# EasyEDA Pro project IP5306锂电池管理模块.epro

# Schematic IP5306充放一体小板_V3.0
Board Name: IP5306充放一体小板_V3.0_接口换插座; Create Date: 2025-09-12; Page Name: power5v; Project Name: IP5306_单MOS控制电路; Schematic Name: IP5306充放一体小板_V3.0; Update Date: 2025-09-12; Company: 嘉立创EDA; Drawed: Robofish; Page Size: A4; Version: V1.0
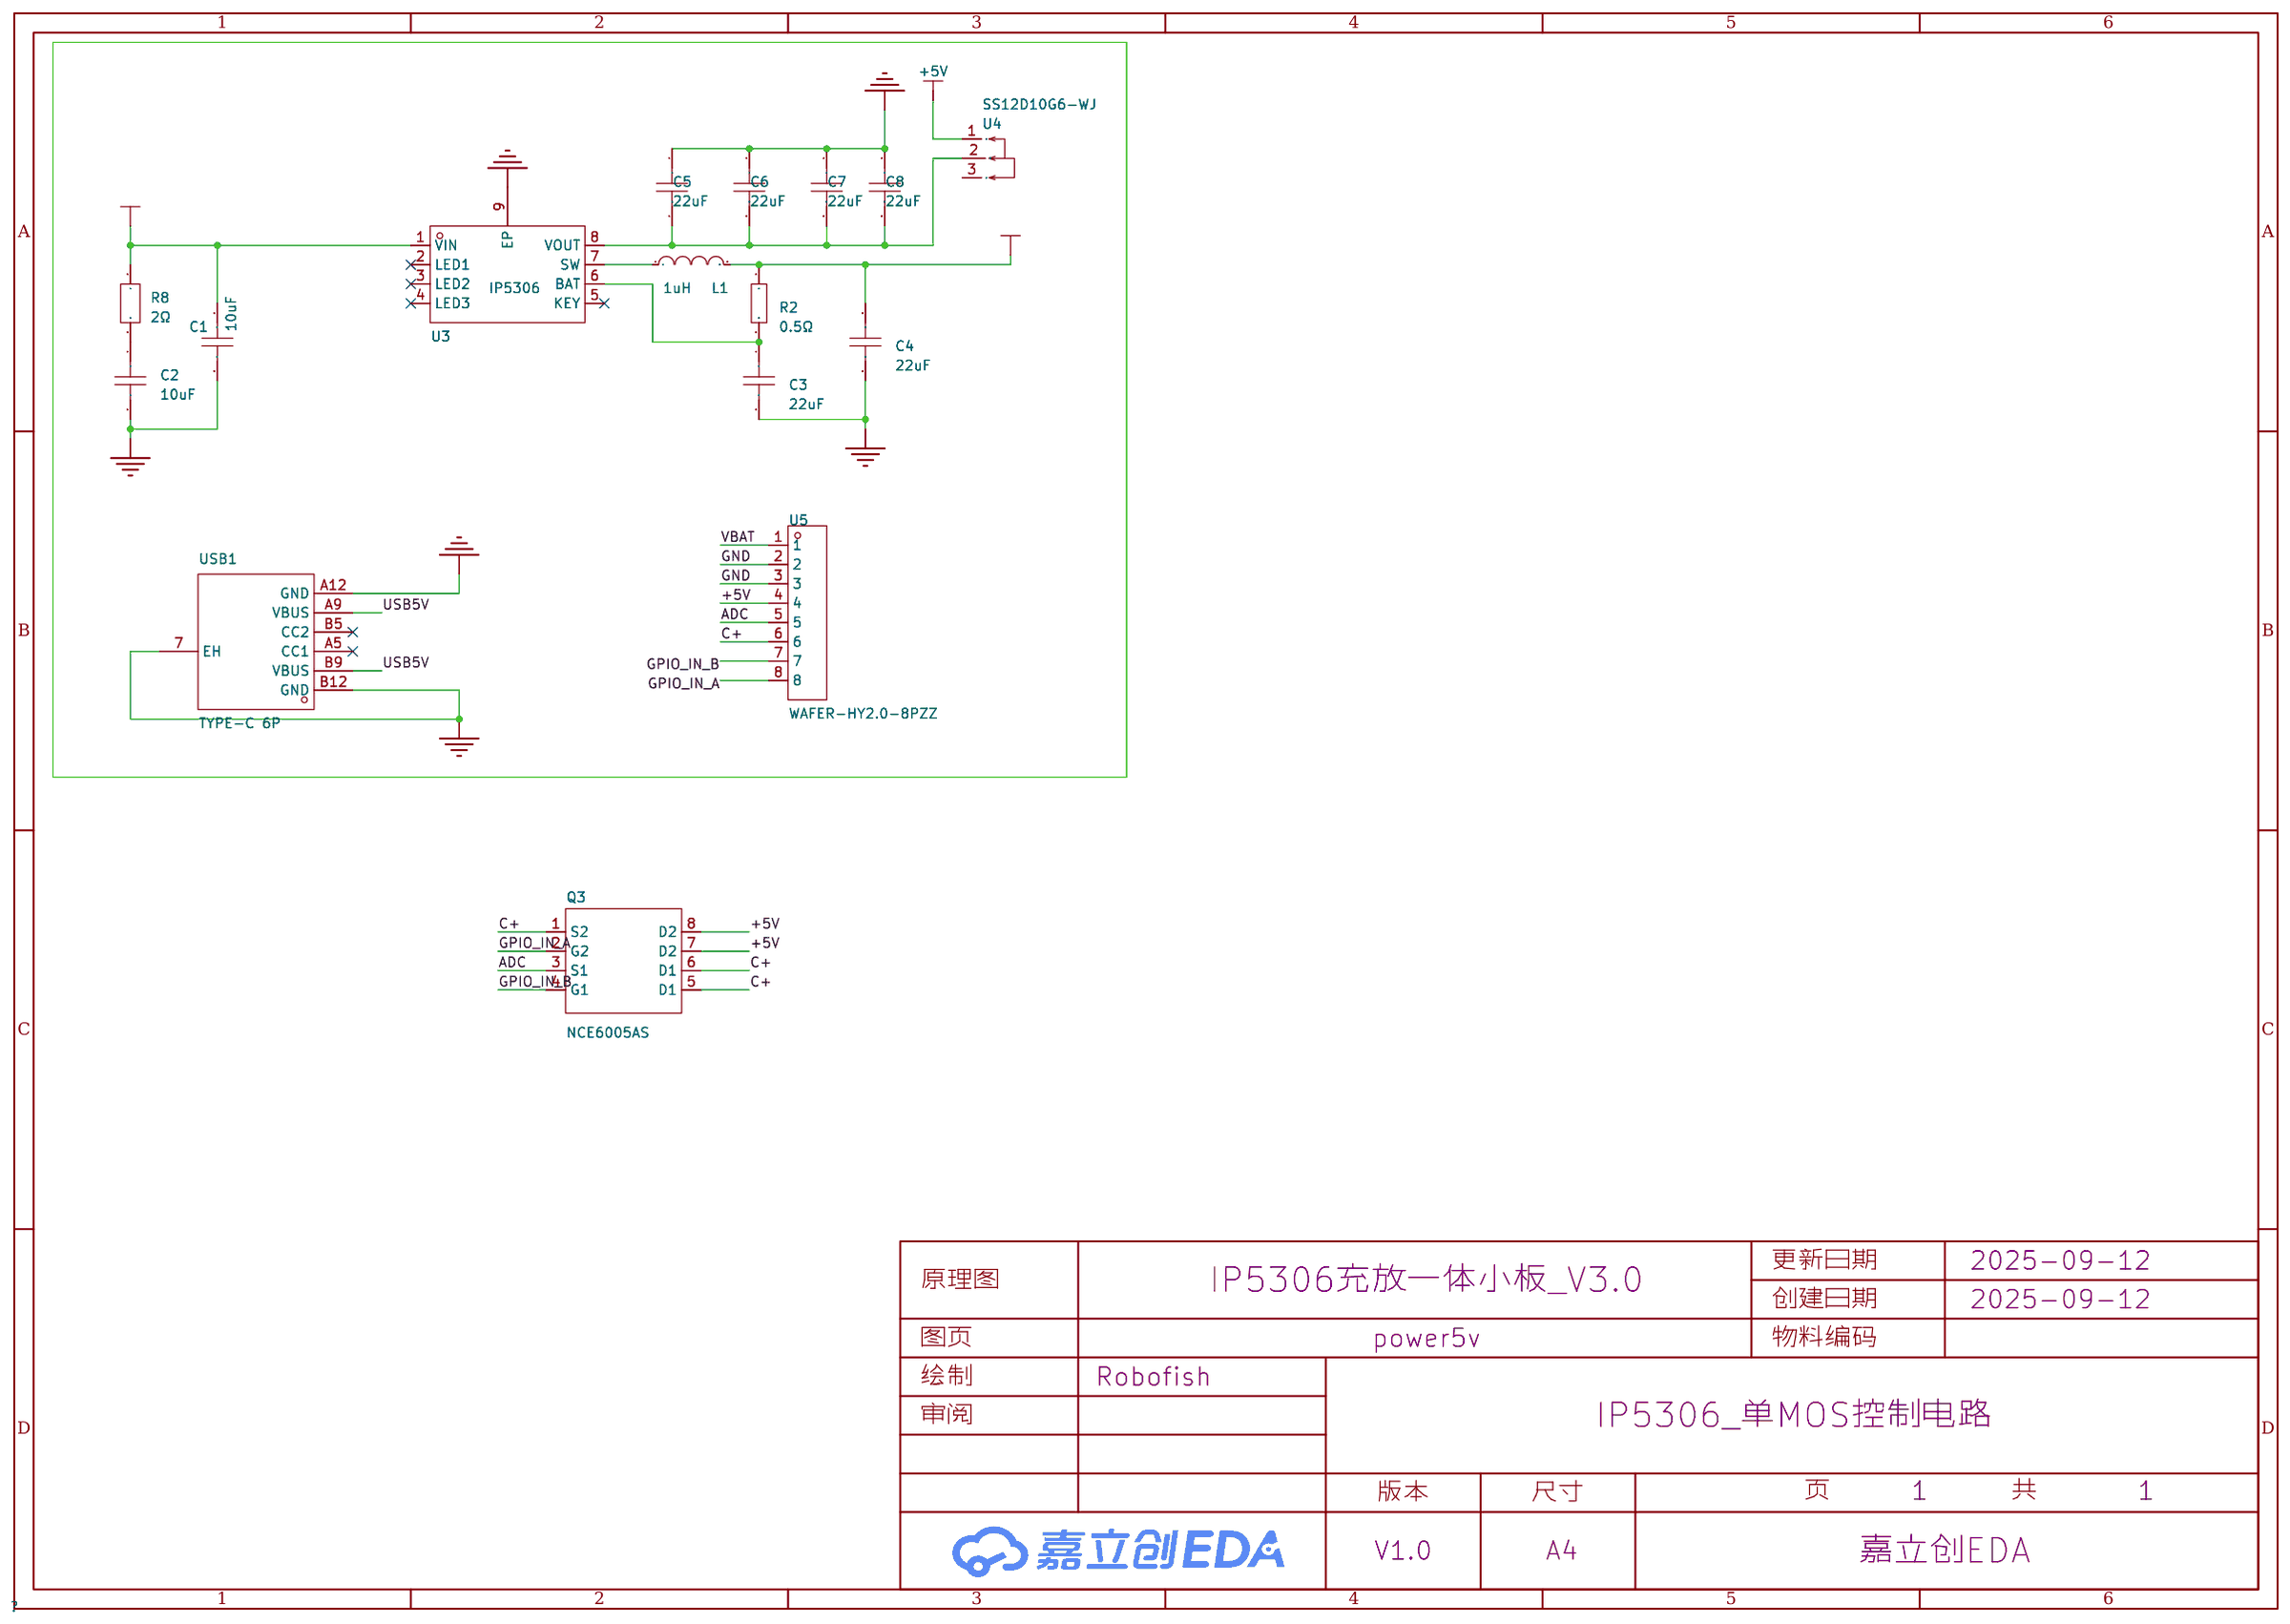
[diagram p0: schematic sheet]

## Parts
C1  10uF  [C0805]
C2  10uF  [C0805]
C3  22uF  [C0805]
C4  22uF  [C0805]
C5  22uF  [C0805]
C6  22uF  [C0805]
C7  22uF  [C0805]
C8  22uF  [C0805]
L1  1uH  [IND-SMD_L4.4-W4.2]
Q3  NCE6005AS  [SOP-8_L4.9-W3.9-P1.27-LS6.0-BL]
R2  0.5Ω  [R0805]
R8  2Ω  [R1206]
U3  IP5306  [ESOP-8_L4.9-W3.9-P1.27-LS6.0-BL-EP]
U4  SS12D10G6-WJ  [SW-TH_3P-P4.80_HX-SS12D10G6-WJ]
U5  WAFER-HY2.0-8PZZ  [CONN-TH_8P-P2.00_WAFER-HY2.0-8PZZ]
USB1  TYPE-C 6P  [TYPE-C-SMD_TYPE-C-6P]

## Library data of the parts
C1 C2 = CL21A106KAYNNNE_C15850: 容值:10uF;精度:±10%;额定电压:25V;材质(温度系数):X5R;; LCSC Part Name: 10uF ±10% 25V; Supplier Part: C15850; Manufacturer: SAMSUNG(三星); Manufacturer Part: CL21A106KAYNNNE; Supplier Footprint: 0805; JLCPCB Part Class: Basic Part; Datasheet: https://atta.szlcsc.com/upload/public/pdf/source/20160218/1457707763339.pdf; Supplier: LCSC; Tolerance: ±10%; Voltage Rated: 25V; Temperature Coefficient: X5R
C3-C8 = CL21A226MAQNNNE_C45783: 容值:22uF;精度:±20%;额定电压:25V;材质(温度系数):X5R;; LCSC Part Name: 22uF ±20% 25V; Supplier Part: C45783; Manufacturer: SAMSUNG(三星); Manufacturer Part: CL21A226MAQNNNE; Supplier Footprint: 0805; JLCPCB Part Class: Basic Part; Datasheet: https://atta.szlcsc.com/upload/public/pdf/source/20160103/1457707727161.pdf; Supplier: LCSC; Tolerance: ±20%; Voltage Rated: 25V; Temperature Coefficient: X5R
L1 = FXL0420-1R0-M: 电感值:1uH;精度:±20%;额定电流:6A;饱和电流(Isat):7A;类型:一体成型电感;; LCSC Part Name: 1uH ±20% 7A; Supplier Part: C167203; Manufacturer: cjiang(长江微电); Supplier Footprint: SMD,4.2x4.4mm; JLCPCB Part Class: 扩展库; Datasheet: https://atta.szlcsc.com/upload/public/pdf/source/20230516/FBADA9890E7FBE97C620F1D8B562D733.pdf; Supplier: LCSC; Tolerance: ±20%; Rated Current: 6A; Saturation Current (Isat): 7A; DC Resistance (DCR): 27mΩ; Type: 一体成型电感
Q3 = NCE6005AS: 数量:2个N沟道;漏源电压(Vdss):60V;连续漏极电流(Id):5A;导通电阻(RDS(on)):45mΩ@4.5V,5A;耗散功率(Pd):2W;阈值电压(Vgs(th)):2.5V@250uA;; LCSC Part Name: 2个N沟道 耐压:60V 电流:5A; Supplier Part: C126151; Manufacturer: NCE(无锡新洁能); Supplier Footprint: SOP-8; JLCPCB Part Class: 扩展库; Datasheet: https://item.szlcsc.com/datasheet/NCE6005AS/137431.html; Supplier: LCSC; Number: 2个N沟道; Drain to Source Voltage: 60V; Current - Continuous Drain(Id): 5A; RDS(on): 45mΩ@4.5V,5A; Pd - Power Dissipation: 2W; Gate Threshold Voltage (Vgs(th)): 2.5V@250uA; Gate Charge(Qg): 22nC@10V; Input Capacitance(Ciss): 979pF; Reverse Transfer Capacitance (Crss@Vds): 100pF; Operating Temperature: -55℃~+150℃; Type: N沟道; Output Capacitance(Coss): 120pF
R2 = 0805W8F500LT5E: 电阻类型:厚膜电阻;阻值:500mΩ;精度:±1%;功率:125mW;最大工作电压:150V;温度系数:±800ppm/℃;; LCSC Part Name: 500mΩ ±1% 125mW 厚膜电阻; Supplier Part: C28319; Manufacturer: UNI-ROYAL(厚声); Supplier Footprint: 0805; JLCPCB Part Class: 扩展库; Datasheet: https://atta.szlcsc.com/upload/public/pdf/source/20200306/C422600_1E6D84923E4A46A82E41ADD87F860B5C.pdf; Supplier: LCSC; Type: 厚膜电阻; Tolerance: ±1%; Power(Watts): 125mW; Overload Voltage (Max): 150V; Temperature Coefficient: ±800ppm/℃; Operating Temperature Range: -55℃~+155℃
R8 = RE1206F1R100: 电阻类型:采样电阻;阻值:100mΩ;精度:±1%;功率:1W;温度系数:±50ppm/℃;; LCSC Part Name: 100mΩ 1W 1206 ±1%; Supplier Part: C46961734; Manufacturer: 捷而瑞; Supplier Footprint: 1206; JLCPCB Part Class: 扩展库; Datasheet: https://atta.szlcsc.com/upload/public/pdf/source/20250325/401775B85EF7B3A580BC34DFED100CB2.pdf; Supplier: LCSC; Type: 采样电阻; Tolerance: ±1%; Power(Watts): 1W; Temperature Coefficient: ±50ppm/℃
U3 = IP5306: 2.1A充电2.4A放电高集成度移动电源SOC; Supplier Part: C181692; Manufacturer: INJOINIC(英集芯); Supplier Footprint: ESOP-8; JLCPCB Part Class: 扩展库; Datasheet: https://atta.szlcsc.com/upload/public/pdf/source/20190627/C384572_9925B3DDC4041BC6108E5AB46A2A0AB1.pdf; Supplier: LCSC
U4 = SS12D10G6-WJ: 电路结构:单刀双掷;安装方式:弯插;开关颜色:黑色;额定电流:2A;额定电压:125V;工作寿命:3千次;; LCSC Part Name: 两档卧式插件 3脚拨动开关弯插 柄长6.0mm; Supplier Part: C7431059; Manufacturer: SHOU HAN(首韩); Supplier Footprint: 插件; JLCPCB Part Class: 扩展库; Datasheet: https://atta.szlcsc.com/upload/public/pdf/source/20240716/65906E925F6A30FB5BD71C0F2E575DBB.pdf; Supplier: LCSC; Circuit: 单刀双掷; Actuator Style: 矩形柱状; Termination Style: PC引脚; Length: 12.7mm; Width: 6.7mm; Switch Height: 12.4mm; Mounting Type: 弯插; Actuator Color: 黑色; Current Rating: 2A; Voltage Rating: 125V; Life: 3千次; Operating Temperature: -25℃~+70℃
U5 = WAFER-HY2.0-8PZZ: 插针结构:1x8P;间距:2mm;安装方式:直插;参考系列:HY;总PIN数:8P;排数:1;每排PIN数:8;行距:-;额定电流:2A;触头材质:黄铜;触头镀层:锡;工作温度:-25℃~+85℃;; LCSC Part Name: 1x8P 间距:2mm 直插 系列:HY; Supplier Part: C5374801; Manufacturer: XUNPU(讯普); Supplier Footprint: 插件,P=2mm; JLCPCB Part Class: 扩展库; Datasheet: https://item.szlcsc.com/datasheet/WAFER-HY2.0-8PZZ/6231113.html; Supplier: LCSC; Pins Structure: 1x8P; Pitch: 2mm; Mounting Type: 直插; Reference Series: HY; Number of Pins: 8P; Number of Rows: 1; Number of PINs Per Row: 8; Current Rating: 2A; Contact Material: 黄铜; Contact Plating: 锡; Operating Temperature: -25℃~+85℃; Voltage Rating: 250V; Plastic Material: LCP; Flame Retardant Rating: UL94V-0; Color: 白色; Z-Height of the Board: 8mm; X-Length of Bottom Edge on Board (Spacing Line): 18mm; Y-Width of Bottom Edge on Board: 5.1mm
USB1 = TYPE-C 6P: 连接器类型:Type-C;标准:USB 3.1;公母:母;安装方式:卧贴;触点数量:6P;端口数量:1;额定电流 - 电源:5A;工作温度范围:-40℃~+85℃;; LCSC Part Name: Type-C 母 卧贴; Supplier Part: C456012; Manufacturer: SHOU HAN(首韩); Supplier Footprint: SMD; JLCPCB Part Class: 扩展库; Datasheet: https://atta.szlcsc.com/upload/public/pdf/source/20201203/C456012_B13F72044DF846EDBE9BDD0D1D3CD166.pdf; Supplier: LCSC; Connector Type: Type-C; Standard: USB 3.1; Gender: 母; Mounting Style: 卧贴; Number of Contacts: 6P; Number of Ports: 1; Current Rating - Power (Max): 5A; Operating Temperature Range: -40℃~+85℃; Rated Voltage (Max): 20V; Connect-Disconnect Life: 3千次; Core Colour: 黑色

## Nets
+5V: Q3.7(D2) Q3.8(D2) U4.1 U5.4
GND: C1.2 C2.2 C3.2 C4.2 C5.1 C6.1 C7.1 C8.1 U3.9(EP) U5.2 U5.3 USB1.7(EH) USB1.A12(GND) USB1.B12(GND)
VBAT: C4.1 L1.2 R2.1 U5.1
ADC: Q3.3(S1) U5.5
C+: Q3.1(S2) Q3.5(D1) Q3.6(D1) U5.6
GPIO_IN_A: Q3.2(G2) U5.8
GPIO_IN_B: Q3.4(G1) U5.7
USB5V: C1.1 R8.1 U3.1(VIN) USB1.A9(VBUS) USB1.B9(VBUS)
$1N828: L1.1 U3.7(SW)
$1N4798: C2.1 R8.2
$1N6635: C3.1 R2.2 U3.6(BAT)
$1N7530: C5.2 C6.2 C7.2 C8.2 U3.8(VOUT) U4.2

Not connected (* = marked no-connect by the designer): U3 2(LED1)* 3(LED2)* 4(LED3)* 5(KEY)*; U4 3; USB1 A5(CC1)* B5(CC2)*

# Board IP5306充放一体小板_V3.0
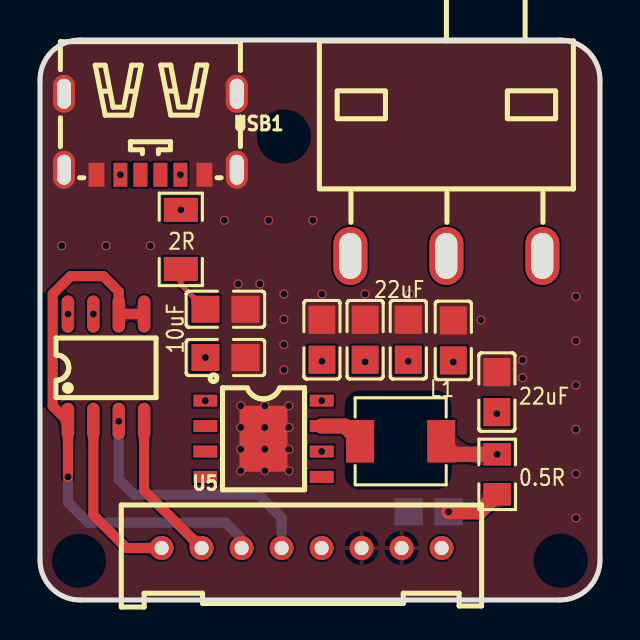
[diagram p1: board, top side]
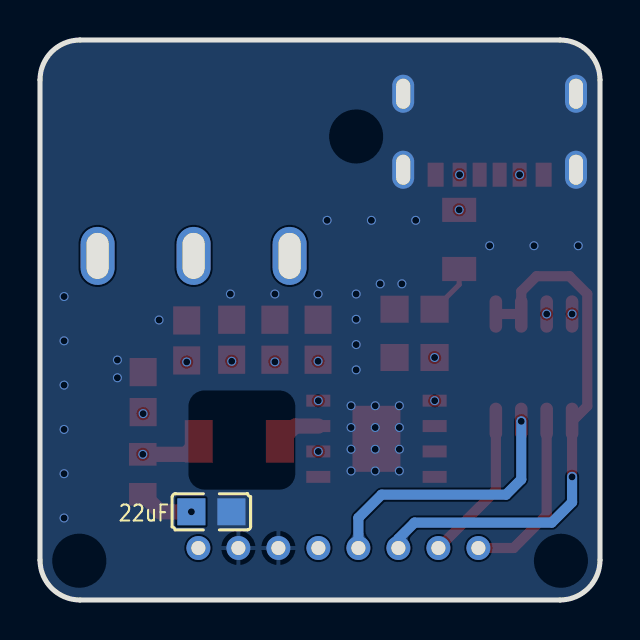
[diagram p2: board, bottom side, seen from below]

Outline 28 x 28 mm; copper layers: Top Layer, GND, PWR, Bottom Layer. Coordinates in mm from the lower left corner of the outline.
Outline path: 0,26 0,2 arc(0.59,0.59) 2,0 26,0 arc(27.41,0.59) 28,2 28,26 arc(27.41,27.41) 26,28 2,28 arc(0.59,27.41) 0,26
Stack: Top Layer 0.035mm 外层铜厚1oz / Dielectric1 0.2104mm 7628 RC49% 8.6mil / GND 0.0152mm 内层铜厚 / Dielectric2 1.065mm 1.1mm H/HOZ Copper / PWR 0.0152mm 内层铜厚 / Dielectric3 0.2104mm 7628 RC49% 8.6mil / Bottom Layer 0.035mm 外层铜厚1oz

## Design rules (mm)
template: 自定义配置
spacing copperThickness1oz (default): track to track 0.102, other pairs 0.152 to 0.3
spacing copperThickness2oz: track to track 0.203, other pairs 0.152 to 0.3
track width copperThickness1oz (default): min 0.127, default 0.254, max 2.54
track width copperThickness2oz: min 0.203, default 0.254, max 2.54
differential pair differentialPair (default): width min 0.127, default 0.254, max 2.54; gap min 0.152, default 0.152
via viaSize (default): diameter min 0.45, default 0.45, max 10; hole min 0.35, default 0.35, max 6.3

## Placement (name value [footprint] x y rotation side)
C1  10uF  [C0805]  9.27 12.12 0 top
C2  10uF  [C0805]  9.27 14.54 0 top
C3  22uF  [C0805]  19.43 4.41 180 bottom
C4  22uF  [C0805]  22.84 10.39 90 top
C5  22uF  [C0805]  14.1 13.01 270 top
C6  22uF  [C0805]  16.26 13.01 270 top
C7  22uF  [C0805]  18.41 13.01 270 top
C8  22uF  [C0805]  20.67 12.98 270 top
L1  1uH  [IND-SMD_L4.4-W4.2]  18.03 7.93 180 top
Q3  NCE6005AS  [SOP-8_L4.9-W3.9-P1.27-LS6.0-BL]  3.3 11.62 0 top
R2  0.5Ω  [R0805]  22.86 6.28 270 top
R8  2Ω  [R1206]  7.04 18.03 270 top
U3  IP5306  [ESOP-8_L4.9-W3.9-P1.27-LS6.0-BL-EP]  11.18 8.06 270 top
U4  SS12D10G6-WJ  [SW-TH_3P-P4.80_HX-SS12D10G6-WJ]  20.32 17.2 180 top
U5  WAFER-HY2.0-8PZZ  [CONN-TH_8P-P2.00_WAFER-HY2.0-8PZZ]  13.08 2.6 0 top
USB1  TYPE-C 6P  [TYPE-C-SMD_TYPE-C-6P]  5.52 23.29 180 top

## Footprints (pads in the part's own frame, mm; a bottom-side part is the same pattern mirrored in y, then rotated)
C0805
  rect 1.41x1.35 smd: 1(-1,0) 2(1,0)
CONN-TH_8P-P2.00_WAFER-HY2.0-8PZZ
  round 1.2 hole 0.7: 1(7,0) 2(5,0) 3(3,0) 4(1,0) 5(-1,0) 6(-3,0) 7(-5,0) 8(-7,0)
ESOP-8_L4.9-W3.9-P1.27-LS6.0-BL-EP
  rect 0.6x1.2 smd: 1(-1.905,-2.909) 2(-0.635,-2.909) 3(0.635,-2.909) 4(1.905,-2.909) 5(1.905,2.909) 6(0.635,2.909) 7(-0.635,2.909) 8(-1.905,2.909)
  rect 3.3x2.4 smd: 9(0,0)
IND-SMD_L4.4-W4.2
  rect 1.4x2.12 smd: 1(2.028,0) 2(-2.028,0)
R0805
  rect 1.133x1.377 smd: 1(-1,0) 2(1,0)
R1206
  rect 1.208x1.701 smd: 1(-1.479,0) 2(1.479,0)
SOP-8_L4.9-W3.9-P1.27-LS6.0-BL
  oval 0.63x1.865 smd: 1(-1.905,-2.683) 2(-0.635,-2.683) 3(0.635,-2.683) 4(1.905,-2.683) 5(1.905,2.683) 6(0.635,2.683) 7(-0.635,2.683) 8(-1.905,2.683)
SW-TH_3P-P4.80_HX-SS12D10G6-WJ
  oval 1.7x2.9 hole 1.1x2.3: 1(-4.8,0) 2(0,0) 3(4.8,0)
TYPE-C-SMD_TYPE-C-6P
  oval 1.1x1.9 hole 0.7x1.5: 7(-4.32,1.775) 7(-4.32,-2.025) 7(4.32,1.775) 7(4.32,-2.025)
  rect 0.7x1.2 smd: A5(-0.5,2.025) A9(1.5,2.025) B5(0.5,2.025) B9(-1.5,2.025)
  rect 0.8x1.2 smd: A12(2.7,2.025) B12(-2.7,2.025)

## Nets
As in the schematic.

Pads without a net: U3 2 3 4 5; U4 3; USB1 A5 B5

## Via types
v1: diameter 0.45, hole 0.35, Top Layer to Bottom Layer, 54 vias

## Routing (per net, layer and track width the routed paths; a pad name or vN(x,y) marks a point on that pad's centre or on a via; arc(x,y) is an arc through that point)
+5V: length 47.7
  PWR w1.016: v1(1.4,14.3) 1.4,7.41 4.43,4.38 12.3,4.38 U5.4 15.6,1.08 22.35,1.08 25.12,3.84 U4.1
  vias: v1(2.67,14.3)
GND:
  vias: v1(1.09,17.71) v1(3.3,17.71) v1(5.52,17.71) v1(9.22,18.98) v1(9.91,15.81) v1(10.03,9.71) v1(10.03,8.62) v1(10.03,7.54) v1(10.03,6.45) v1(10.99,15.81) v1(11.24,9.71) v1(11.24,8.62) v1(11.24,7.54) v1(11.24,6.45) v1(11.43,18.98) v1(12.19,15.3) v1(12.19,14.04) v1(12.19,12.77) v1(12.19,11.51) v1(12.45,9.71) v1(12.45,8.62) v1(12.45,7.54) v1(12.45,6.45) v1(13.64,18.98) v1(14.1,15.3) v1(16.26,15.3) v1(18.48,15.3) v1(22.05,14) v1(24.13,12) v1(24.13,11.11) v1(26.8,15.17) v1(26.8,12.96) v1(26.8,10.74) v1(26.8,8.53) v1(26.8,6.31) v1(26.8,4.1)
VBAT: length 9.9
  Top Layer w0.762: L1.2 20.71,7.28 v1(22.86,7.28)
  PWR w1.016: U5.1 21.84,2.6 22.86,3.62 v1(22.86,7.28)
  vias: v1(22.84,9.32)
ADC: length 13.4
  Bottom Layer w0.508: v1(3.94,8.93) 3.94,6.03 4.7,5.27 10.92,5.27 12.08,4.11 U5.5
C+: length 27
  Top Layer w0.508: v1(1.4,6.16) Q3.1 0.63,9.7 0.63,15.3 1.52,16.19 3.18,16.19 3.94,15.43 3.94,14.3 Q3.5
  Bottom Layer w0.508: U5.6 10.08,3.06 9.27,3.87 2.41,3.87 1.4,4.89 v1(1.4,6.16)
GPIO_IN_A: length 8.8
  Top Layer w0.508: Q3.2 2.67,4.25 4.32,2.6 U5.8
GPIO_IN_B: length 7.5
  Top Layer w0.508: Q3.4 5.21,5.47 U5.7
USB5V: length 7.9
  PWR w1.016: v1(8.27,12.12) 7.04,13.35 v1(7.04,19.51)
  vias: v1(4.02,21.26) v1(7.02,21.26) v1(8.27,9.97)
$1N828: length 2.2
  Top Layer w0.762: U3.7 15.24,8.7 L1.1
$1N4798: length 2.5
  Top Layer w0.254: C2.1 7.04,15.77 R8.2
$1N6635: length 11.4
  Top Layer w0.762: v1(20.43,4.41) 21.99,4.41 R2.2
  PWR w0.762: v1(20.43,4.41) 15.34,4.41 14.08,5.66 v1(14.08,7.43)
$1N7530:
  vias: v1(14.1,11.94) v1(14.08,9.97) v1(16.26,11.91) v1(18.41,11.94) v1(20.67,11.9)

## Copper pours and planes (outline as drawn; the poured copper is in the pictures)
+5V on PWR: 0.78,15.44 3.3,15.44 3.3,13.1 0.78,13.1
GND on Top Layer: -8.38,38.79 41.78,38.79 41.78,-12 -8.38,-12
GND on Bottom Layer: -4.19,37.65 37.34,37.65 37.34,-5.78 -4.19,-5.78
GND on GND: 0.26,27.74 27.74,27.74 27.74,0.26 0.26,0.26
GND on PWR: -8.51,37.4 38.74,37.4 38.74,-10.86 -8.51,-10.86
VBAT on PWR: 21.23,10.39 24.26,10.39 24.26,5.9 21.23,5.9
USB5V on PWR: 7.04,13.35 9.13,13.35 9.13,9.57 7.04,9.57
USB5V on PWR: 3.43,22.28 8.64,22.28 8.64,18.73 3.43,18.73
$1N7530 on PWR: 13.23,9.45 14.99,9.45 14.99,10.71 21.65,10.71 21.57,10.79 21.57,18.77 19.34,18.77 19.3,18.73 19.3,13.01 13.23,13.01

Small or netless copper shapes (teardrops, artwork), in the pictures only: 14 on Top Layer, 2 on Bottom Layer, 8 on GND, 4 on PWR

## Text on the board
Bottom Silkscreen Layer: 22uF
Top Silkscreen Layer: 10uF | 2R | 22uF | L1 | 0.5R
